# EAGLE design BT board (EAGLE 7.1.0)
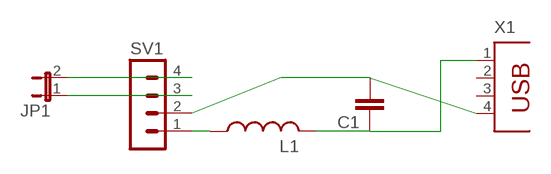
[diagram p0: schematic, sheet 1]

## Parts
C1  C5/2.5  [C5B2.5]
JP1  JP1E  [JP1]
L1  L-US0204V  [0204V]
SV1  MA04-1  [MA04-1]
X1  PN87520  [PN87520]

## Nets
N$1: L1.1 SV1.1
N$2: C1.1 L1.2 X1.1
N$3: C1.2 SV1.2 X1.4
N$4: JP1.2 SV1.4
N$5: JP1.1 SV1.3
Unconnected: X1.2 X1.3

## Library data of the parts
C1 = capacitor-wima:C: CAPACITOR naming: grid - package width
JP1 = jumper:JP1E: JUMPER
L1 = resistor:L-US: INDUCTOR, American symbol
SV1 = con-lstb:MA04-1: PIN HEADER; OC_FARNELL: unknown; OC_NEWARK: unknown
X1 = con-berg:PN87520: BERG USB connector; OC_FARNELL: unknown; OC_NEWARK: unknown

## Board
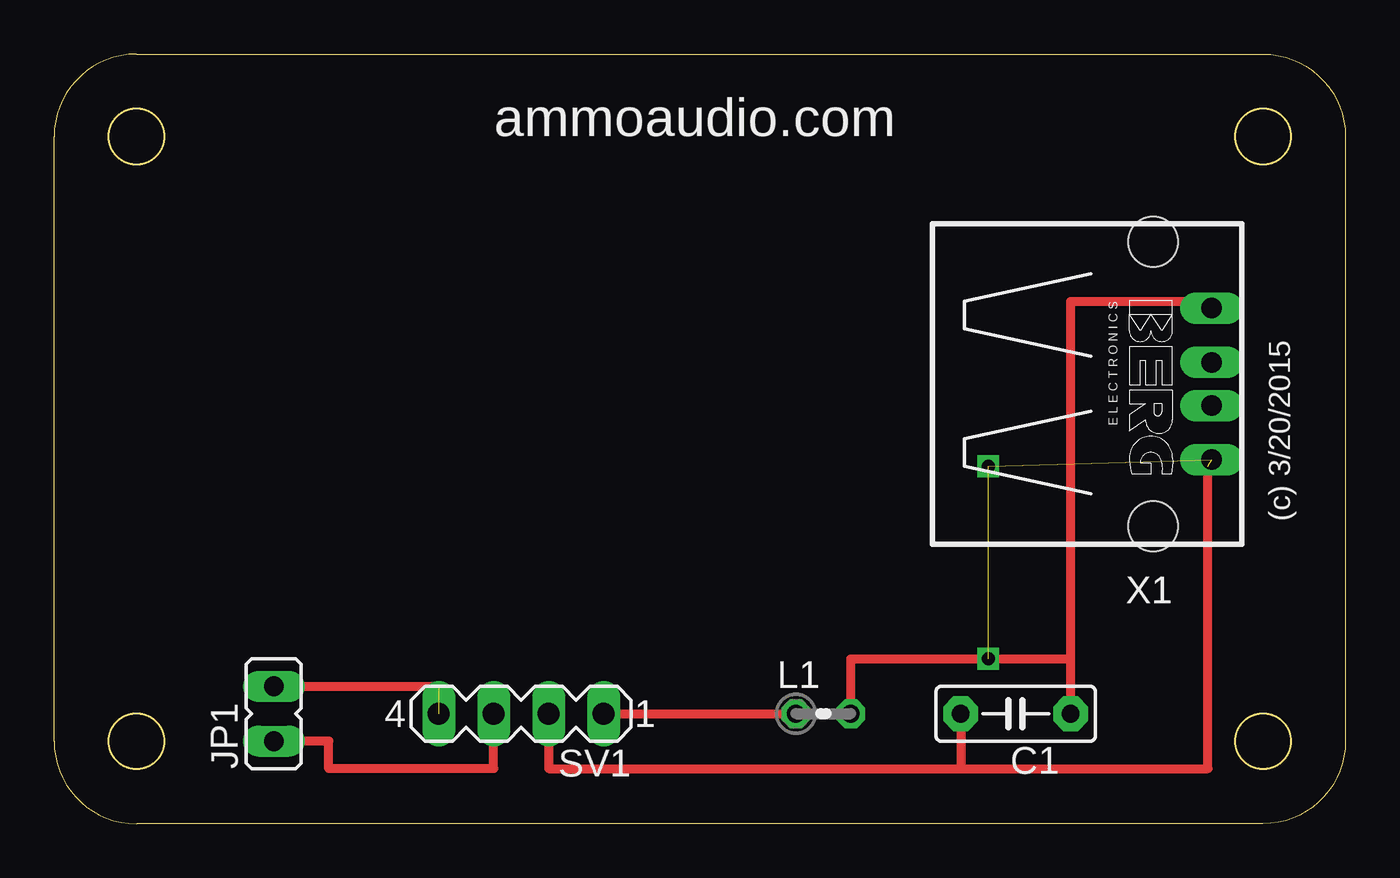
[diagram p1: board, top side]

Size 59.69 x 35.56 mm. Coordinates in mm from the lower left corner, seen from the top.
Outline: 3.81,35.56 55.88,35.56 arc-90 59.69,31.75 59.69,3.81 arc-90 55.88,0 3.81,0 arc-90 0,3.81 0,31.75 arc-90 3.81,35.56
Outline: circle at 55.88,3.81 radius 1.27
Outline: circle at 55.88,31.75 radius 1.27
Outline: circle at 3.81,31.75 radius 1.27
Outline: circle at 3.81,3.81 radius 1.27
Copper layers (1*16): Top 0.035mm / dielectric 1.5mm / Bottom 0.035mm
Design rules "default": minimum track width 10mil, minimum drill 24mil, track to track 8mil, track to pad 8mil, pad to pad 8mil, via to via 8mil, smd to smd 8mil, copper to edge 40mil, drill to drill 8mil, minimum pad ring 10mil, minimum via ring 8mil, stop-mask expansion 4mil, vias tented up to drill 0mil, thermal gap 10mil

### Footprints (pad centres in the part's own frame; a part is rotated, then mirrored left to right if it is on the bottom)
C5B2.5 = drill 0.813 pad 1.6 octagon: 1 -2.54,0; 2 2.54,0
JP1 = drill 0.914 long: 1 0,-1.27; 2 0,1.27
0204V = drill 0.813 octagon: 1 -1.27,0; 2 1.27,0
MA04-1 = drill 1.016 long: 1 -3.81,0; 2 -1.27,0; 3 1.27,0; 4 3.81,0
PN87520 = drill 0.95 long: 1 -3.5,2.71; 2 -1,2.71; 3 1,2.71; 4 3.5,2.71 | hole 2.3: -6.57,0; 6.57,0

### Placement (x,y rotation side)
C1  44.45,5.08 180 top
JP1  10.16,5.08 0 top
L1  35.56,5.08 0 top
SV1  21.59,5.08 180 top
X1  50.8,20.32 270 top

### Tracks (layer width: path | path; a pad name or v marks a point on that pad's centre or on a via)
N$1
  Top 0.406: SV1.1 L1.1
N$2
  Top 0.406: C1.1 46.99,7.62 | L1.2 36.83,7.62 46.99,7.62 | 46.99,7.62 46.99,24.13 53.51,24.13 X1.1
N$3  (via drill 0.6)  (3 unrouted)
  Top 0.406: SV1.2 22.86,2.54 41.91,2.54 | C1.2 41.91,2.54 | 41.91,2.54 53.34,2.54 53.34,16.51
  other vias: 43.18,7.62 43.18,16.51
N$4  (1 unrouted)
  Top 0.406: JP1.2 17.78,6.35 17.78,3.81
N$5
  Top 0.406: SV1.3 20.32,2.54 12.7,2.54 12.7,3.81 JP1.1

### Text on the board
tNames: ammoaudio.com | (c) 3/20/2015